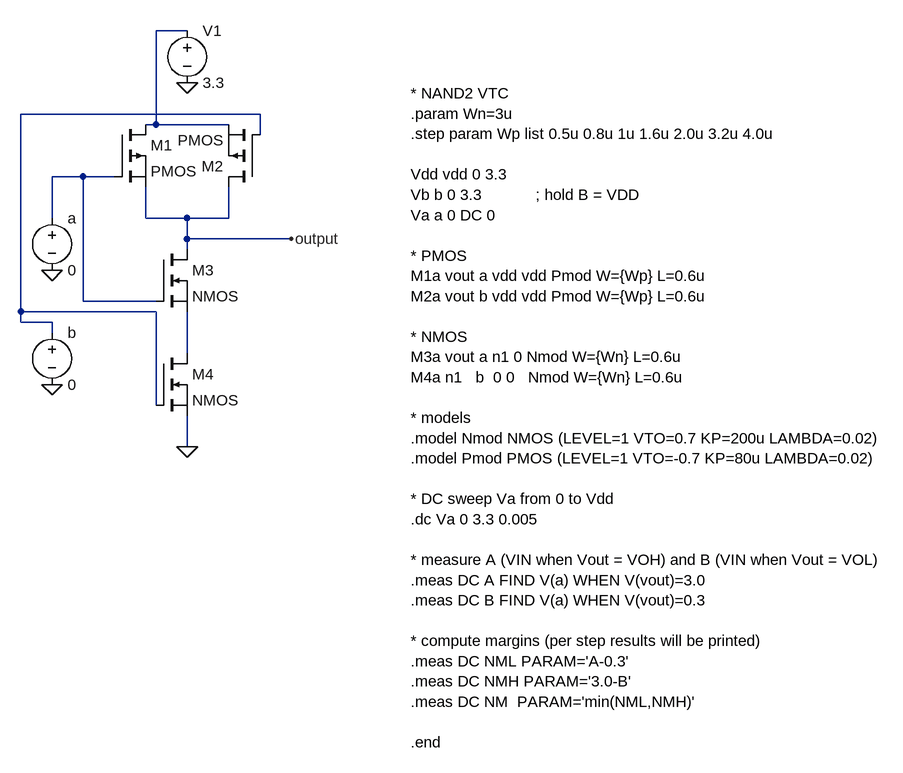
[diagram p0: schematic D.asc]
D.asc, the LTspice schematic file:
Version 4.1
SHEET 1 1512 864
WIRE 192 -144 144 -144
WIRE 304 -16 -64 -16
WIRE 144 0 144 -144
WIRE 144 0 128 0
WIRE 256 0 144 0
WIRE 304 16 304 -16
WIRE 32 80 -16 80
WIRE 80 80 32 80
WIRE -16 144 -16 80
WIRE 128 144 128 96
WIRE 192 144 128 144
WIRE 256 144 256 96
WIRE 256 144 192 144
WIRE 192 176 192 144
WIRE 352 176 192 176
WIRE 192 192 192 176
WIRE 32 272 32 80
WIRE 144 272 32 272
WIRE -64 288 -64 -16
WIRE 144 288 -64 288
WIRE -64 304 -64 288
WIRE -16 304 -64 304
WIRE -16 320 -16 304
WIRE 192 352 192 288
WIRE 144 432 144 288
WIRE 192 496 192 448
FLAG 192 -64 0
FLAG 192 496 0
FLAG 352 176 output
FLAG -16 224 0
FLAG -16 400 0
SYMBOL pmos 80 0 R0
SYMATTR InstName M1
SYMBOL pmos 304 96 R180
SYMATTR InstName M2
SYMBOL voltage 192 -160 R0
WINDOW 123 0 0 Left 0
WINDOW 39 0 0 Left 0
SYMATTR InstName V1
SYMATTR Value 3.3
SYMBOL nmos 144 192 R0
SYMATTR InstName M3
SYMBOL nmos 144 352 R0
SYMATTR InstName M4
SYMBOL voltage -16 128 R0
WINDOW 123 0 0 Left 0
WINDOW 39 0 0 Left 0
SYMATTR InstName a
SYMATTR Value 0
SYMBOL voltage -16 304 R0
WINDOW 123 0 0 Left 0
WINDOW 39 0 0 Left 0
SYMATTR InstName b
SYMATTR Value 0
TEXT 536 -48 Left 2 !* NAND2 VTC \n.param Wn=3u\n.step param Wp list 0.5u 0.8u 1u 1.6u 2.0u 3.2u 4.0u\n \nVdd vdd 0 3.3\nVb b 0 3.3            ; hold B = VDD\nVa a 0 DC 0         \n \n* PMOS\nM1a vout a vdd vdd Pmod W={Wp} L=0.6u\nM2a vout b vdd vdd Pmod W={Wp} L=0.6u\n \n* NMOS\nM3a vout a n1 0 Nmod W={Wn} L=0.6u\nM4a n1   b  0 0   Nmod W={Wn} L=0.6u\n \n* models\n.model Nmod NMOS (LEVEL=1 VTO=0.7 KP=200u LAMBDA=0.02)\n.model Pmod PMOS (LEVEL=1 VTO=-0.7 KP=80u LAMBDA=0.02)\n \n* DC sweep Va from 0 to Vdd\n.dc Va 0 3.3 0.005\n \n* measure A (VIN when Vout = VOH) and B (VIN when Vout = VOL)\n.meas DC A FIND V(a) WHEN V(vout)=3.0\n.meas DC B FIND V(a) WHEN V(vout)=0.3\n \n* compute margins (per step results will be printed)\n.meas DC NML PARAM='A-0.3'\n.meas DC NMH PARAM='3.0-B'\n.meas DC NM  PARAM='min(NML,NMH)'\n \n.end

The netlist it stands for:
* D.asc
M1 N001 N003 output output PMOS
M2 output N002 N001 N001 PMOS
V1 N001 0 3.3
M3 output N003 N004 N004 NMOS
M4 N004 N002 0 0 NMOS
V§a N003 0 0
V§b N002 0 0
.model NMOS NMOS
.model PMOS PMOS
.lib standard.mos
* NAND2 VTC
.param Wn=3u
.step param Wp list 0.5u 0.8u 1u 1.6u 2.0u 3.2u 4.0u
Vdd vdd 0 3.3
Vb b 0 3.3            ; hold B = VDD
Va a 0 DC 0
* PMOS
M1a vout a vdd vdd Pmod W={Wp} L=0.6u
M2a vout b vdd vdd Pmod W={Wp} L=0.6u
* NMOS
M3a vout a n1 0 Nmod W={Wn} L=0.6u
M4a n1   b  0 0   Nmod W={Wn} L=0.6u
* models
.model Nmod NMOS (LEVEL=1 VTO=0.7 KP=200u LAMBDA=0.02)
.model Pmod PMOS (LEVEL=1 VTO=-0.7 KP=80u LAMBDA=0.02)
* DC sweep Va from 0 to Vdd
.dc Va 0 3.3 0.005
* measure A (VIN when Vout = VOH) and B (VIN when Vout = VOL)
.meas DC A FIND V(a) WHEN V(vout)=3.0
.meas DC B FIND V(a) WHEN V(vout)=0.3
* compute margins (per step results will be printed)
.meas DC NML PARAM='A-0.3'
.meas DC NMH PARAM='3.0-B'
.meas DC NM  PARAM='min(NML,NMH)'
.end
.backanno
.end